# Altium project STM32H750核心板.PrjPcb
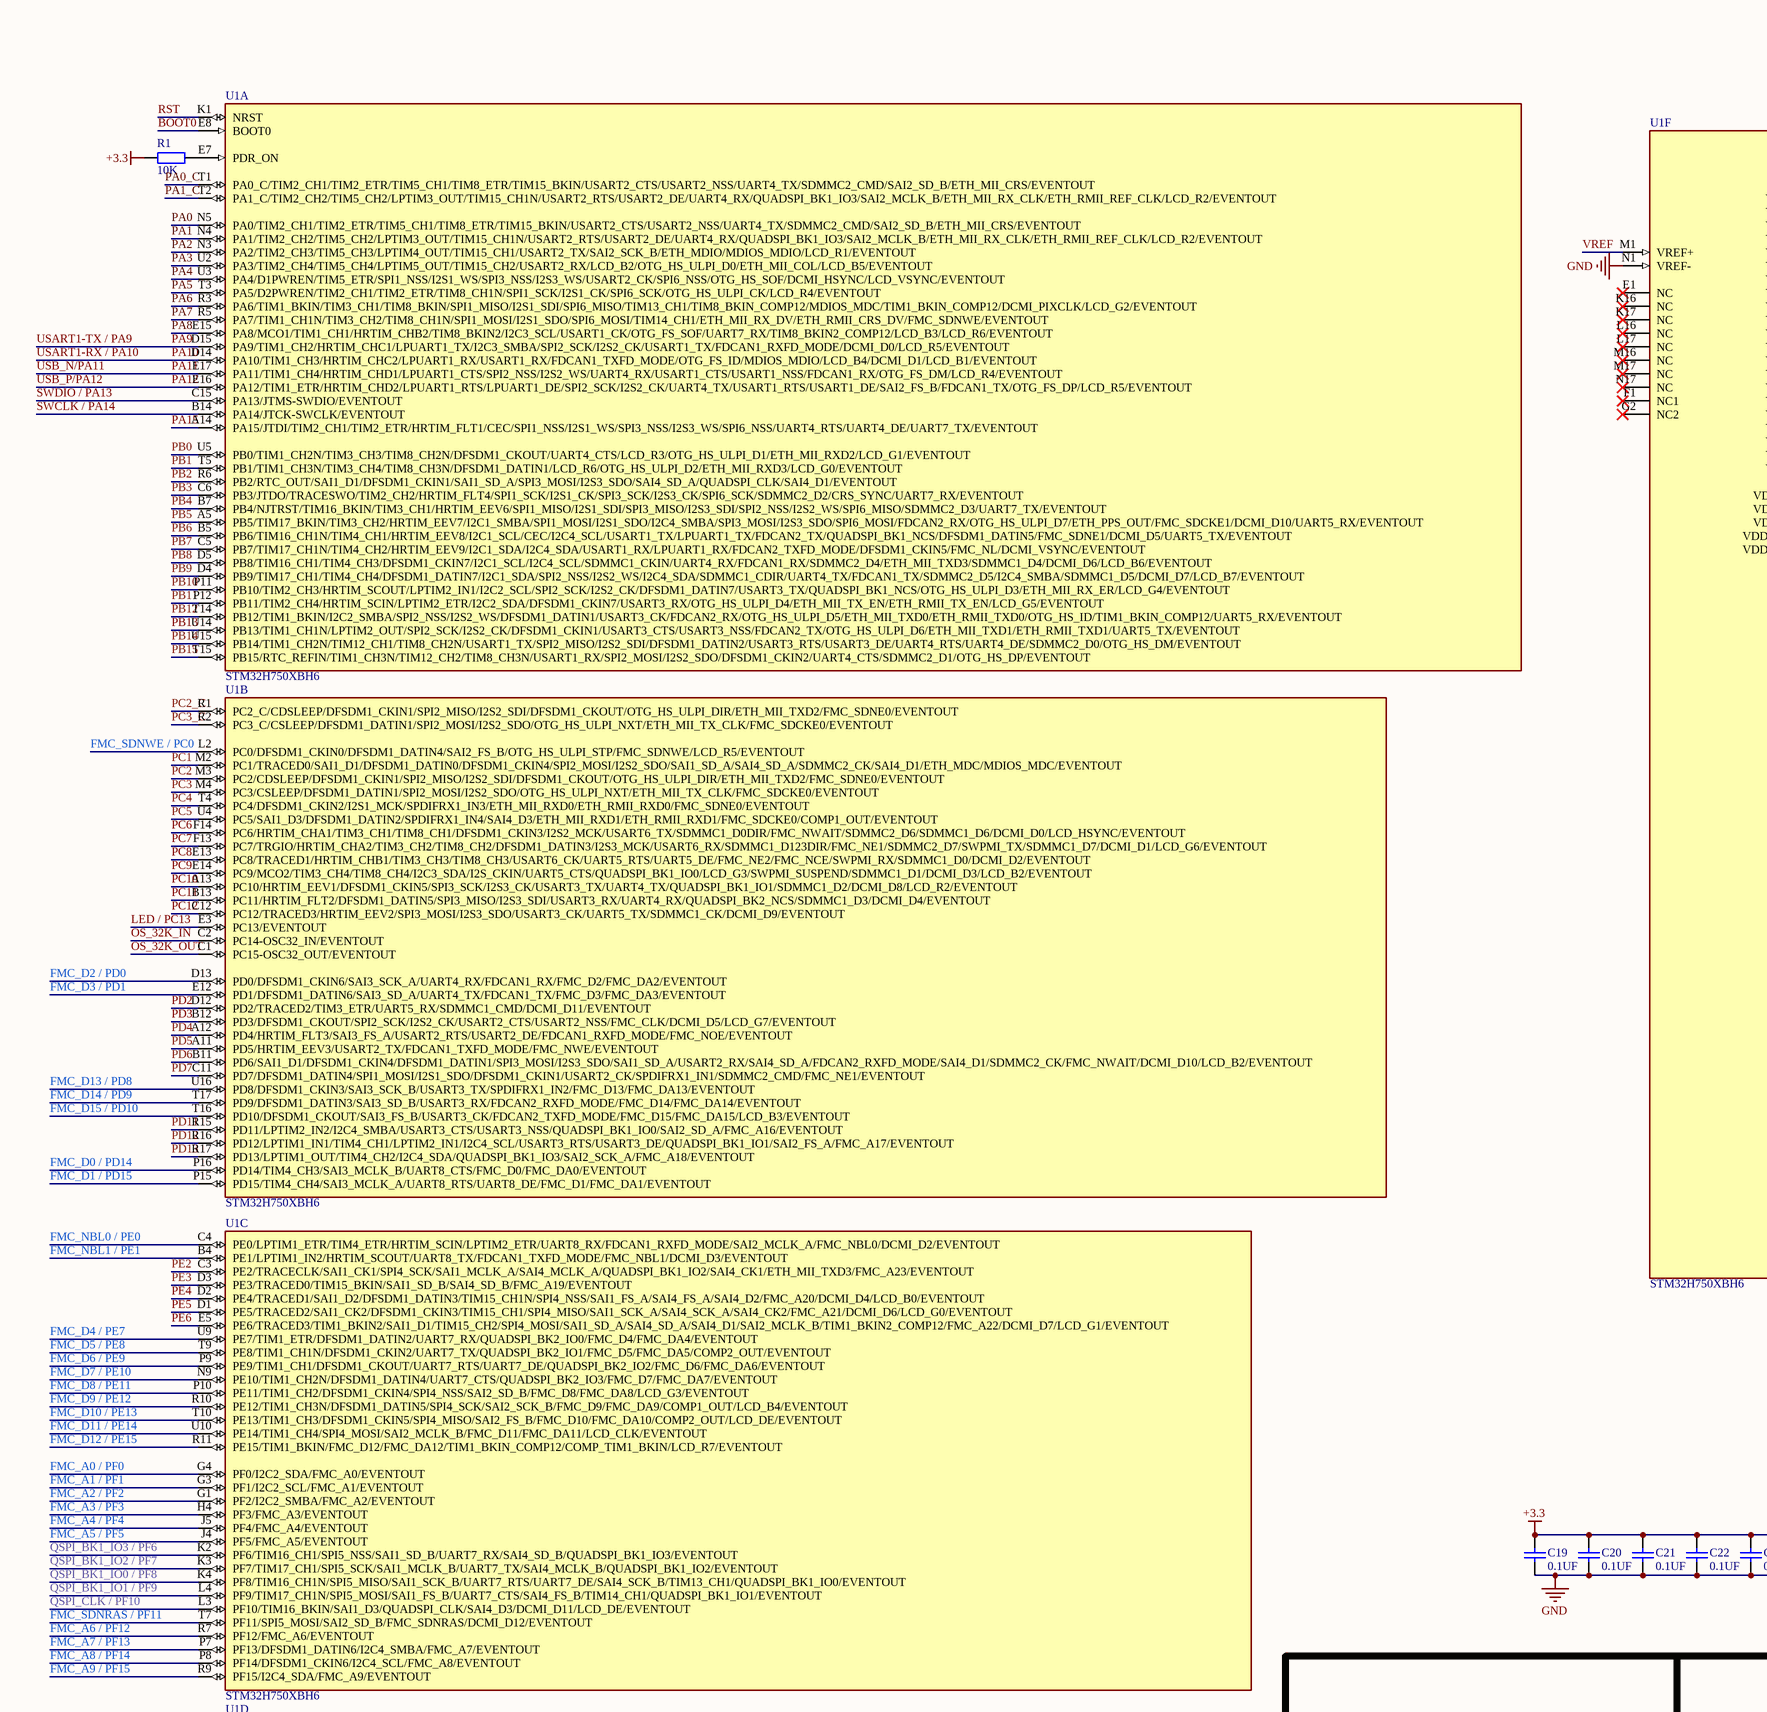
[diagram p0: Sheet1.SchDoc, top left]
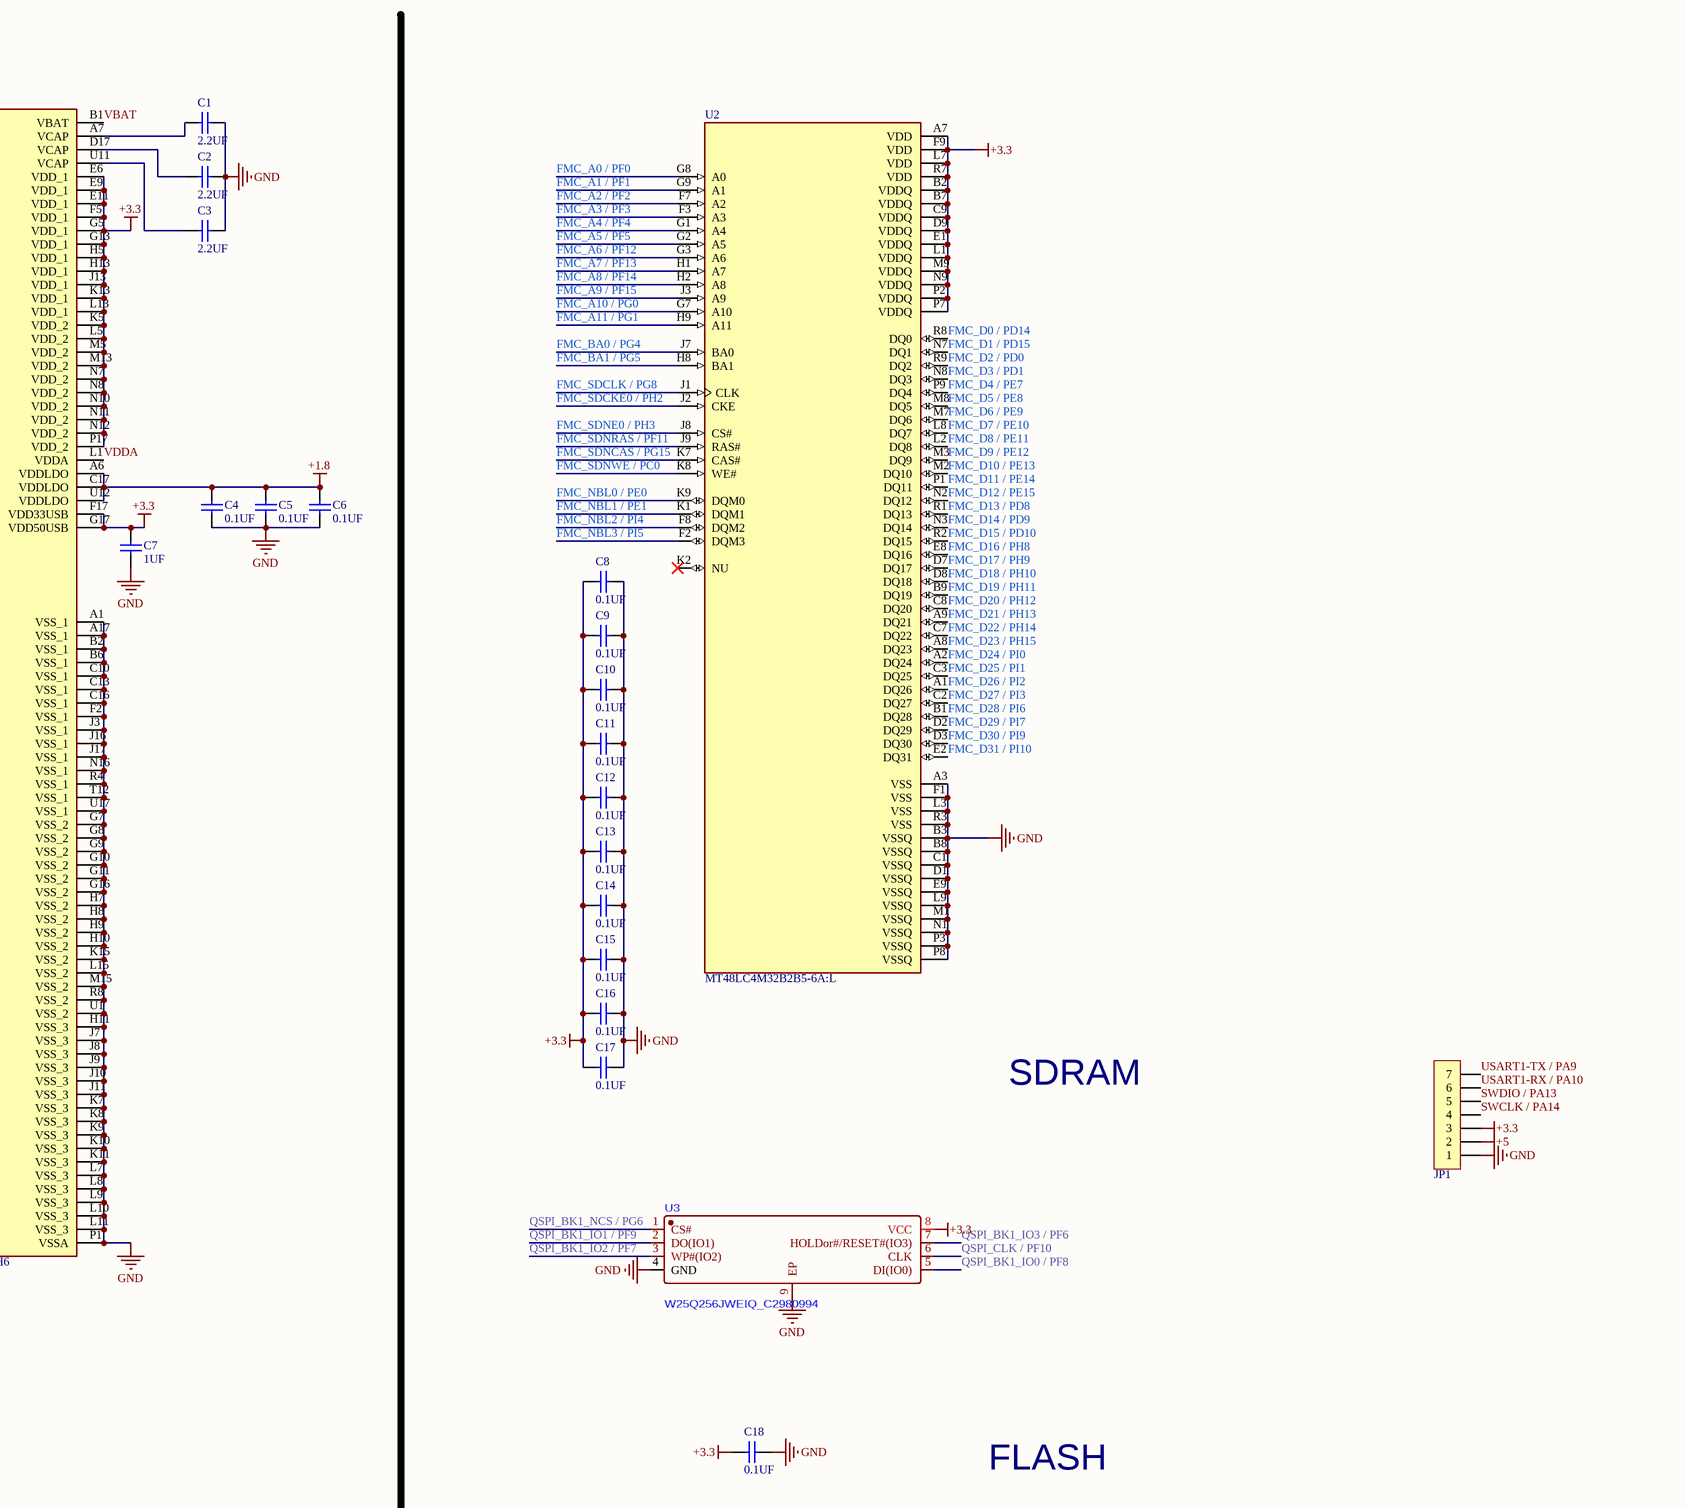
[diagram p1: Sheet1.SchDoc, top right]
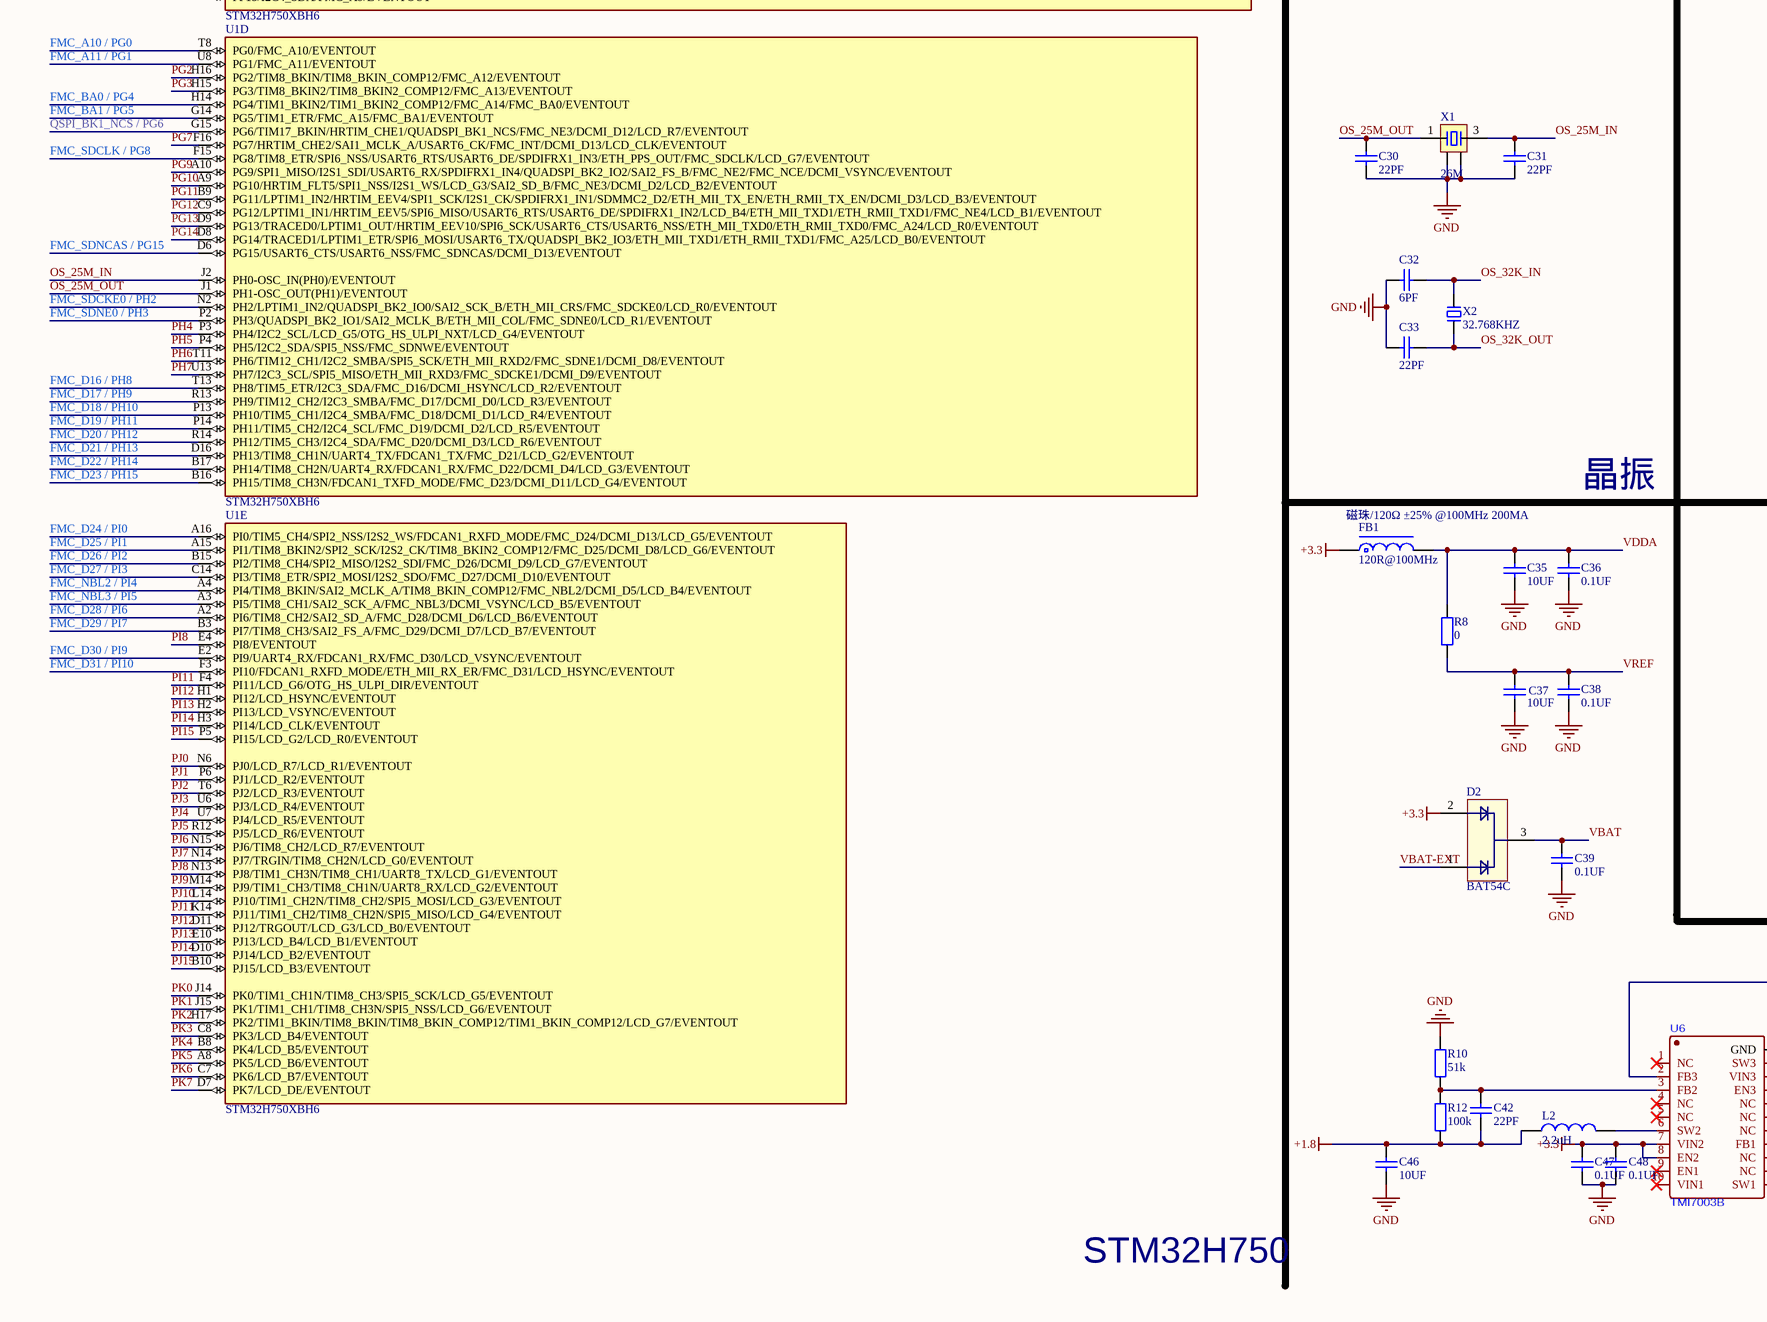
[diagram p2: Sheet1.SchDoc, bottom left]
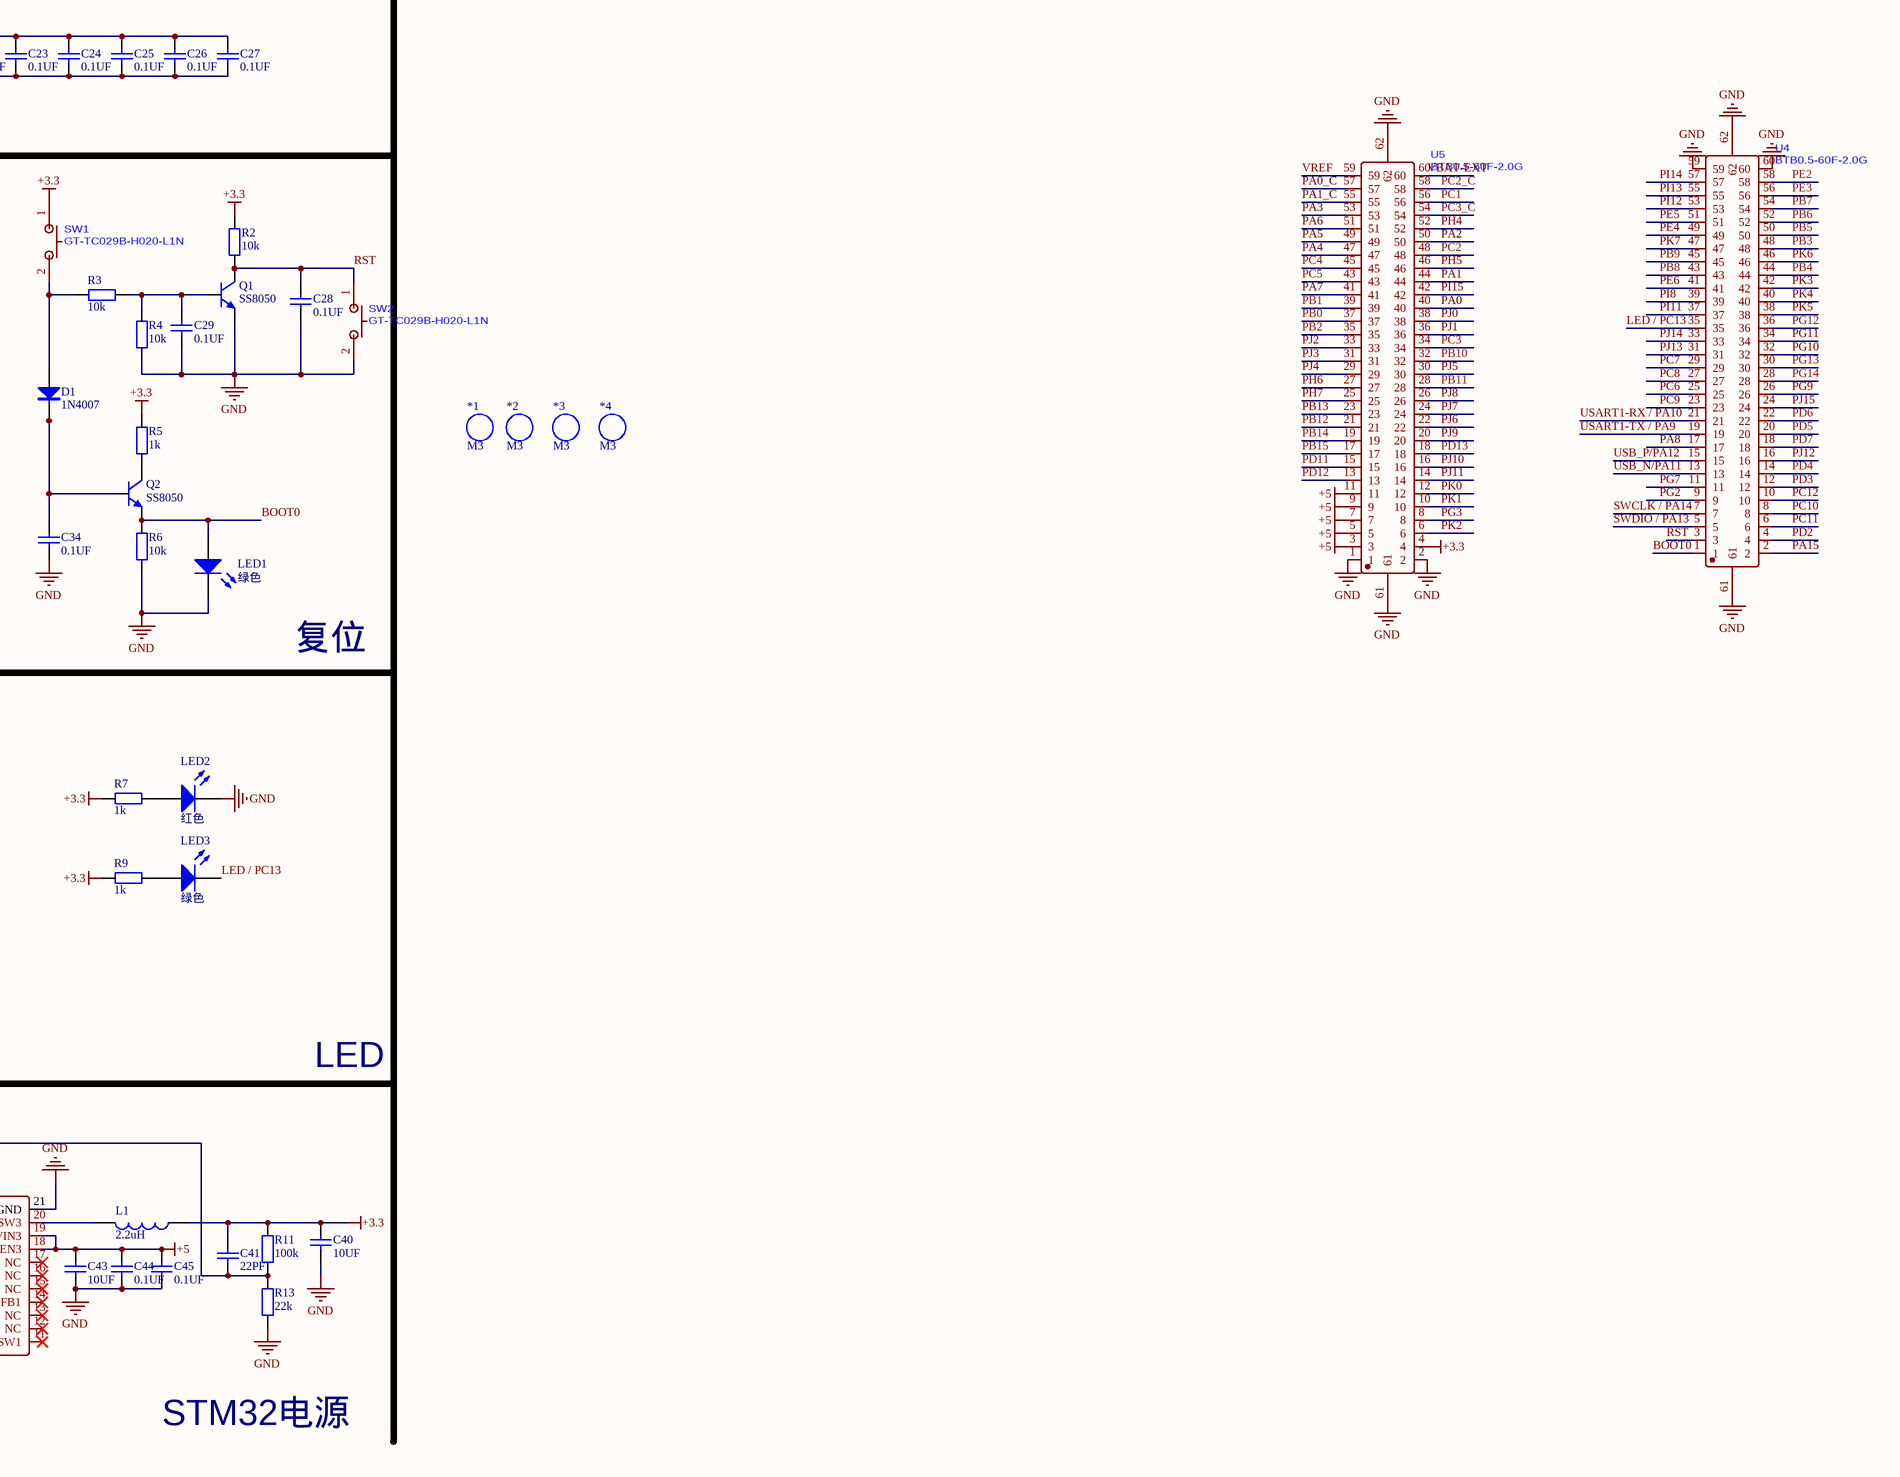
[diagram p3: Sheet1.SchDoc, bottom right]
1 sheet, 86 parts. Net scope: global (net labels, ports and power ports of the same name join across sheets).
Board file: PCB1.PcbDoc

## Sheet Sheet1.SchDoc
size A1; SheetNumber: 1; SheetTotal: 1

### Parts
*1  M3  [M3 125X200]
*2  M3  [M3 125X200]
*3  M3  [M3 125X200]
*4  M3  [M3 125X200]
C1  2.2UF  [C0402_L]
C2  2.2UF  [C0402_L]
C3  2.2UF  [C0402_L]
C4  0.1UF  [C0402_L]
C5  0.1UF  [C0402_L]
C6  0.1UF  [C0402_L]
C7  1UF  [C0402_L]
C8  0.1UF  [C0402_M]
C9  0.1UF  [C0402_M]
C10  0.1UF  [C0402_M]
C11  0.1UF  [C0402_M]
C12  0.1UF  [C0402_M]
C13  0.1UF  [C0402_M]
C14  0.1UF  [C0402_M]
C15  0.1UF  [C0402_M]
C16  0.1UF  [C0402_M]
C17  0.1UF  [C0402_M]
C18  0.1UF  [C0402_L]
C19  0.1UF  [C0402_M]
C20  0.1UF  [C0402_M]
C21  0.1UF  [C0402_M]
C22  0.1UF  [C0402_M]
C23  0.1UF  [C0402_M]
C24  0.1UF  [C0402_M]
C25  0.1UF  [C0402_M]
C26  0.1UF  [C0402_M]
C27  0.1UF  [C0402_M]
C28  0.1UF  [C0402_L]
C29  0.1UF  [C0402_L]
C30  22PF  [C0402_L]
C31  22PF  [C0402_L]
C32  6PF  [C0402_L]
C33  22PF  [C0402_L]
C34  0.1UF  [C0402_L]
C35  10UF  [C0603_L]
C36  0.1UF  [C0402_L]
C37  10UF  [C0603_L]
C38  0.1UF  [C0402_L]
C39  0.1UF  [C0402_L]
C40  10UF  [C0603_L]
C41  22PF  [C0402_L]
C42  22PF  [C0402_L]
C43  10UF  [C0603_L]
C44  0.1UF  [C0402_L]
C45  0.1UF  [C0402_L]
C46  10UF  [C0603_L]
C47  0.1UF  [C0402_L]
C48  0.1UF  [C0402_L]
D1  1N4007  [SOD-123]
D2  BAT54C  [SOT23-3N]
FB1  120R@100MHz  [FB0603]
JP1  CON-6P  [SH1.0-LT-7P]  (value not drawn)
L1  2.2uH  [L0805]
L2  2.2uH  [L0805]
LED1  绿色  [LED0603_G]
LED2  红色  [LED0603_G]
LED3  绿色  [LED0603_G]
Q1  SS8050  [SOT23-3N]
Q2  SS8050  [SOT23-3N]
R1  10K  [R0402_L]
R2  10k  [R0402_L]
R3  10k  [R0402_L]
R4  10k  [R0402_L]
R5  1k  [R0402_L]
R6  10k  [R0402_L]
R7  1k  [R0402_L]
R8  0  [R0402_L]
R9  1k  [R0402_L]
R10  51k  [R0402_L]
R11  100k  [R0402_L]
R12  100k  [R0402_L]
R13  22k  [R0402_L]
SW1  GT-TC029B-H020-L1N  [SW-SMD_L3.9-W2.9-P4.15-LS5.0]
SW2  GT-TC029B-H020-L1N  [SW-SMD_L3.9-W2.9-P4.15-LS5.0]
U1  STM32H750XBH6  [IC_STM32H750XBH6]  (parts A,B,C,D,E,F of 6)
U2  MT48LC4M32B2B5-6A:L  [BGA90C80P9X15_800X1300X100N]
U3  W25Q256JWEIQ_C2980994  [WSON-8_L8.0-W6.0-P1.27-TL-EP-1]
U4  BTB0.5-60F-2.0G  [CONN-SMD_60P-P0.50_BTB0.5-60F-2.0G]
U5  BTB0.5-60F-2.0G  [CONN-SMD_60P-P0.50_BTB0.5-60F-2.0G]
U6  TMI7003B  [QFN-20_L3.0-W3.0-P0.40-BL-EP1.7]
X1  26M  [XTAL-3225-4P]
X2  32.768KHZ  [XTAL-3215-2P]

### Nets
+1.8: C4.1 C5.1 C6.1 C42.2 C46.1 L2.1 R12.1 U1.A6(VDDLDO) U1.C17(VDDLDO) U1.U12(VDDLDO)
+3.3: C7.2 C8.2 C9.2 C10.2 C11.2 C12.2 C13.2 C14.2 C15.2 C16.2 C17.2 C18.2 C19.2 C20.2 C21.2 C22.2 C23.2 C24.2 C25.2 C26.2 C27.2 C40.2 C41.2 C47.2 C48.2 D2.2 FB1.1 JP1.3 L1.1 R1.1 R2.2 R5.2 R7.1 R9.1 R11.1 SW1.1 U1.E6(VDD_1) U1.E9(VDD_1) U1.E11(VDD_1) U1.F5(VDD_1) U1.F17(VDD33USB) U1.G5(VDD_1) U1.G13(VDD_1) U1.G17(VDD50USB) U1.H5(VDD_1) U1.H13(VDD_1) U1.J13(VDD_1) U1.K5(VDD_2) U1.K13(VDD_1) U1.L5(VDD_2) U1.L13(VDD_1) U1.M5(VDD_2) U1.M13(VDD_2) U1.N7(VDD_2) U1.N8(VDD_2) U1.N10(VDD_2) U1.N11(VDD_2) U1.N12(VDD_2) U1.P17(VDD_2) U2.A7(VDD) U2.B2(VDDQ) U2.B7(VDDQ) U2.C9(VDDQ) U2.D9(VDDQ) U2.E1(VDDQ) U2.F9(VDD) U2.L1(VDDQ) U2.L7(VDD) U2.M9(VDDQ) U2.N9(VDDQ) U2.P2(VDDQ) U2.P7(VDDQ) U2.R7(VDD) U3.8(VCC) U5.4 U6.7(VIN2) U6.8(EN2)
+5: C43.2 C44.2 C45.2 JP1.2 U5.3 U5.5 U5.7 U5.9 U5.11 U6.18(EN3) U6.19(VIN3)
GND: C1.1 C2.1 C3.1 C4.2 C5.2 C6.2 C7.1 C8.1 C9.1 C10.1 C11.1 C12.1 C13.1 C14.1 C15.1 C16.1 C17.1 C18.1 C19.1 C20.1 C21.1 C22.1 C23.1 C24.1 C25.1 C26.1 C27.1 C28.2 C29.2 C30.1 C31.1 C32.2 C33.2 C34.2 C35.1 C36.1 C37.1 C38.1 C39.2 C40.1 C43.1 C44.1 C45.1 C46.2 C47.1 C48.1 JP1.1 LED1.2(K) LED2.2(K) Q1.2(E) R4.1 R6.1 R10.2 R13.2 SW2.2 U1.A1(VSS_1) U1.A17(VSS_1) U1.B2(VSS_1) U1.B6(VSS_1) U1.C10(VSS_1) U1.C13(VSS_1) U1.C16(VSS_1) U1.F2(VSS_1) U1.G7(VSS_2) U1.G8(VSS_2) U1.G9(VSS_2) U1.G10(VSS_2) U1.G11(VSS_2) U1.G16(VSS_2) U1.H7(VSS_2) U1.H8(VSS_2) U1.H9(VSS_2) U1.H10(VSS_2) U1.H11(VSS_3) U1.J3(VSS_1) U1.J7(VSS_3) U1.J8(VSS_3) U1.J9(VSS_3) U1.J10(VSS_3) U1.J11(VSS_3) U1.J16(VSS_1) U1.J17(VSS_1) U1.K7(VSS_3) U1.K8(VSS_3) U1.K9(VSS_3) U1.K10(VSS_3) U1.K11(VSS_3) U1.K15(VSS_2) U1.L7(VSS_3) U1.L8(VSS_3) U1.L9(VSS_3) U1.L10(VSS_3) U1.L11(VSS_3) U1.L15(VSS_2) U1.M15(VSS_2) U1.N1(VREF-) U1.N16(VSS_1) U1.P1(VSSA) U1.R4(VSS_1) U1.R8(VSS_2) U1.T12(VSS_1) U1.U1(VSS_2) U1.U17(VSS_1) U2.A3(VSS) U2.B3(VSSQ) U2.B8(VSSQ) U2.C1(VSSQ) U2.D1(VSSQ) U2.E9(VSSQ) U2.F1(VSS) U2.L3(VSS) U2.L9(VSSQ) U2.M1(VSSQ) U2.N1(VSSQ) U2.P3(VSSQ) U2.P8(VSSQ) U2.R3(VSS) U3.4(GND) U3.9(EP) U4.59 U4.60 U4.61 U4.62 U5.1 U5.2 U5.61 U5.62 U6.21(GND) X1.2 X1.4
BOOT0: LED1.1(A) Q2.2(E) R6.2 U1.E8(BOOT0) U4.1
FMC_A0 / PF0: U1.G4(PF0/I2C2_SDA/FMC_A0/EVENTOUT) U2.G8(A0)
FMC_A1 / PF1: U1.G3(PF1/I2C2_SCL/FMC_A1/EVENTOUT) U2.G9(A1)
FMC_A2 / PF2: U1.G1(PF2/I2C2_SMBA/FMC_A2/EVENTOUT) U2.F7(A2)
FMC_A3 / PF3: U1.H4(PF3/FMC_A3/EVENTOUT) U2.F3(A3)
FMC_A4 / PF4: U1.J5(PF4/FMC_A4/EVENTOUT) U2.G1(A4)
FMC_A5 / PF5: U1.J4(PF5/FMC_A5/EVENTOUT) U2.G2(A5)
FMC_A6 / PF12: U1.R7(PF12/FMC_A6/EVENTOUT) U2.G3(A6)
FMC_A7 / PF13: U1.P7(PF13/DFSDM1_DATIN6/I2C4_SMBA/FMC_A7/EVENTOUT) U2.H1(A7)
FMC_A8 / PF14: U1.P8(PF14/DFSDM1_CKIN6/I2C4_SCL/FMC_A8/EVENTOUT) U2.H2(A8)
FMC_A9 / PF15: U1.R9(PF15/I2C4_SDA/FMC_A9/EVENTOUT) U2.J3(A9)
FMC_A10 / PG0: U1.T8(PG0/FMC_A10/EVENTOUT) U2.G7(A10)
FMC_A11 / PG1: U1.U8(PG1/FMC_A11/EVENTOUT) U2.H9(A11)
FMC_BA0 / PG4: U1.H14(PG4/TIM1_BKIN2/TIM1_BKIN2_COMP12/FMC_A14/FMC_BA0/EVENTOUT) U2.J7(BA0)
FMC_BA1 / PG5: U1.G14(PG5/TIM1_ETR/FMC_A15/FMC_BA1/EVENTOUT) U2.H8(BA1)
FMC_D0 / PD14: U1.P16(PD14/TIM4_CH3/SAI3_MCLK_B/UART8_CTS/FMC_D0/FMC_DA0/EVENTOUT) U2.R8(DQ0)
FMC_D1 / PD15: U1.P15(PD15/TIM4_CH4/SAI3_MCLK_A/UART8_RTS/UART8_DE/FMC_D1/FMC_DA1/EVENTOUT) U2.N7(DQ1)
FMC_D2 / PD0: U1.D13(PD0/DFSDM1_CKIN6/SAI3_SCK_A/UART4_RX/FDCAN1_RX/FMC_D2/FMC_DA2/EVENTOUT) U2.R9(DQ2)
FMC_D3 / PD1: U1.E12(PD1/DFSDM1_DATIN6/SAI3_SD_A/UART4_TX/FDCAN1_TX/FMC_D3/FMC_DA3/EVENTOUT) U2.N8(DQ3)
FMC_D4 / PE7: U1.U9(PE7/TIM1_ETR/DFSDM1_DATIN2/UART7_RX/QUADSPI_BK2_IO0/FMC_D4/FMC_DA4/EVENTOUT) U2.P9(DQ4)
FMC_D5 / PE8: U1.T9(PE8/TIM1_CH1N/DFSDM1_CKIN2/UART7_TX/QUADSPI_BK2_IO1/FMC_D5/FMC_DA5/COMP2_OUT/EVENTOUT) U2.M8(DQ5)
FMC_D6 / PE9: U1.P9(PE9/TIM1_CH1/DFSDM1_CKOUT/UART7_RTS/UART7_DE/QUADSPI_BK2_IO2/FMC_D6/FMC_DA6/EVENTOUT) U2.M7(DQ6)
FMC_D7 / PE10: U1.N9(PE10/TIM1_CH2N/DFSDM1_DATIN4/UART7_CTS/QUADSPI_BK2_IO3/FMC_D7/FMC_DA7/EVENTOUT) U2.L8(DQ7)
FMC_D8 / PE11: U1.P10(PE11/TIM1_CH2/DFSDM1_CKIN4/SPI4_NSS/SAI2_SD_B/FMC_D8/FMC_DA8/LCD_G3/EVENTOUT) U2.L2(DQ8)
FMC_D9 / PE12: U1.R10(PE12/TIM1_CH3N/DFSDM1_DATIN5/SPI4_SCK/SAI2_SCK_B/FMC_D9/FMC_DA9/COMP1_OUT/LCD_B4/EVENTOUT) U2.M3(DQ9)
FMC_D10 / PE13: U1.T10(PE13/TIM1_CH3/DFSDM1_CKIN5/SPI4_MISO/SAI2_FS_B/FMC_D10/FMC_DA10/COMP2_OUT/LCD_DE/EVENTOUT) U2.M2(DQ10)
FMC_D11 / PE14: U1.U10(PE14/TIM1_CH4/SPI4_MOSI/SAI2_MCLK_B/FMC_D11/FMC_DA11/LCD_CLK/EVENTOUT) U2.P1(DQ11)
FMC_D12 / PE15: U1.R11(PE15/TIM1_BKIN/FMC_D12/FMC_DA12/TIM1_BKIN_COMP12/COMP_TIM1_BKIN/LCD_R7/EVENTOUT) U2.N2(DQ12)
FMC_D13 / PD8: U1.U16(PD8/DFSDM1_CKIN3/SAI3_SCK_B/USART3_TX/SPDIFRX1_IN2/FMC_D13/FMC_DA13/EVENTOUT) U2.R1(DQ13)
FMC_D14 / PD9: U1.T17(PD9/DFSDM1_DATIN3/SAI3_SD_B/USART3_RX/FDCAN2_RXFD_MODE/FMC_D14/FMC_DA14/EVENTOUT) U2.N3(DQ14)
FMC_D15 / PD10: U1.T16(PD10/DFSDM1_CKOUT/SAI3_FS_B/USART3_CK/FDCAN2_TXFD_MODE/FMC_D15/FMC_DA15/LCD_B3/EVENTOUT) U2.R2(DQ15)
FMC_D16 / PH8: U1.T13(PH8/TIM5_ETR/I2C3_SDA/FMC_D16/DCMI_HSYNC/LCD_R2/EVENTOUT) U2.E8(DQ16)
FMC_D17 / PH9: U1.R13(PH9/TIM12_CH2/I2C3_SMBA/FMC_D17/DCMI_D0/LCD_R3/EVENTOUT) U2.D7(DQ17)
FMC_D18 / PH10: U1.P13(PH10/TIM5_CH1/I2C4_SMBA/FMC_D18/DCMI_D1/LCD_R4/EVENTOUT) U2.D8(DQ18)
FMC_D19 / PH11: U1.P14(PH11/TIM5_CH2/I2C4_SCL/FMC_D19/DCMI_D2/LCD_R5/EVENTOUT) U2.B9(DQ19)
FMC_D20 / PH12: U1.R14(PH12/TIM5_CH3/I2C4_SDA/FMC_D20/DCMI_D3/LCD_R6/EVENTOUT) U2.C8(DQ20)
FMC_D21 / PH13: U1.D16(PH13/TIM8_CH1N/UART4_TX/FDCAN1_TX/FMC_D21/LCD_G2/EVENTOUT) U2.A9(DQ21)
FMC_D22 / PH14: U1.B17(PH14/TIM8_CH2N/UART4_RX/FDCAN1_RX/FMC_D22/DCMI_D4/LCD_G3/EVENTOUT) U2.C7(DQ22)
FMC_D23 / PH15: U1.B16(PH15/TIM8_CH3N/FDCAN1_TXFD_MODE/FMC_D23/DCMI_D11/LCD_G4/EVENTOUT) U2.A8(DQ23)
FMC_D24 / PI0: U1.A16(PI0/TIM5_CH4/SPI2_NSS/I2S2_WS/FDCAN1_RXFD_MODE/FMC_D24/DCMI_D13/LCD_G5/EVENTOUT) U2.A2(DQ24)
FMC_D25 / PI1: U1.A15(PI1/TIM8_BKIN2/SPI2_SCK/I2S2_CK/TIM8_BKIN2_COMP12/FMC_D25/DCMI_D8/LCD_G6/EVENTOUT) U2.C3(DQ25)
FMC_D26 / PI2: U1.B15(PI2/TIM8_CH4/SPI2_MISO/I2S2_SDI/FMC_D26/DCMI_D9/LCD_G7/EVENTOUT) U2.A1(DQ26)
FMC_D27 / PI3: U1.C14(PI3/TIM8_ETR/SPI2_MOSI/I2S2_SDO/FMC_D27/DCMI_D10/EVENTOUT) U2.C2(DQ27)
FMC_D28 / PI6: U1.A2(PI6/TIM8_CH2/SAI2_SD_A/FMC_D28/DCMI_D6/LCD_B6/EVENTOUT) U2.B1(DQ28)
FMC_D29 / PI7: U1.B3(PI7/TIM8_CH3/SAI2_FS_A/FMC_D29/DCMI_D7/LCD_B7/EVENTOUT) U2.D2(DQ29)
FMC_D30 / PI9: U1.E2(PI9/UART4_RX/FDCAN1_RX/FMC_D30/LCD_VSYNC/EVENTOUT) U2.D3(DQ30)
FMC_D31 / PI10: U1.F3(PI10/FDCAN1_RXFD_MODE/ETH_MII_RX_ER/FMC_D31/LCD_HSYNC/EVENTOUT) U2.E2(DQ31)
FMC_NBL0 / PE0: U1.C4(PE0/LPTIM1_ETR/TIM4_ETR/HRTIM_SCIN/LPTIM2_ETR/UART8_RX/FDCAN1_RXFD_MODE/SAI2_MCLK_A/FMC_NBL0/DCMI_D2/EVENTOUT) U2.K9(DQM0)
FMC_NBL1 / PE1: U1.B4(PE1/LPTIM1_IN2/HRTIM_SCOUT/UART8_TX/FDCAN1_TXFD_MODE/FMC_NBL1/DCMI_D3/EVENTOUT) U2.K1(DQM1)
FMC_NBL2 / PI4: U1.A4(PI4/TIM8_BKIN/SAI2_MCLK_A/TIM8_BKIN_COMP12/FMC_NBL2/DCMI_D5/LCD_B4/EVENTOUT) U2.F8(DQM2)
FMC_NBL3 / PI5: U1.A3(PI5/TIM8_CH1/SAI2_SCK_A/FMC_NBL3/DCMI_VSYNC/LCD_B5/EVENTOUT) U2.F2(DQM3)
FMC_SDCKE0 / PH2: U1.N2(PH2/LPTIM1_IN2/QUADSPI_BK2_IO0/SAI2_SCK_B/ETH_MII_CRS/FMC_SDCKE0/LCD_R0/EVENTOUT) U2.J2(CKE)
FMC_SDCLK / PG8: U1.F15(PG8/TIM8_ETR/SPI6_NSS/USART6_RTS/USART6_DE/SPDIFRX1_IN3/ETH_PPS_OUT/FMC_SDCLK/LCD_G7/EVENTOUT) U2.J1(CLK)
FMC_SDNCAS / PG15: U1.D6(PG15/USART6_CTS/USART6_NSS/FMC_SDNCAS/DCMI_D13/EVENTOUT) U2.K7(CAS#)
FMC_SDNE0 / PH3: U1.P2(PH3/QUADSPI_BK2_IO1/SAI2_MCLK_B/ETH_MII_COL/FMC_SDNE0/LCD_R1/EVENTOUT) U2.J8(CS#)
FMC_SDNRAS / PF11: U1.T7(PF11/SPI5_MOSI/SAI2_SD_B/FMC_SDNRAS/DCMI_D12/EVENTOUT) U2.J9(RAS#)
FMC_SDNWE / PC0: U1.L2(PC0/DFSDM1_CKIN0/DFSDM1_DATIN4/SAI2_FS_B/OTG_HS_ULPI_STP/FMC_SDNWE/LCD_R5/EVENTOUT) U2.K8(WE#)
LED / PC13: LED3.2(K) U1.E3(PC13/EVENTOUT) U4.35
OS_25M_IN: C31.2 U1.J2(PH0-OSC_IN(PH0)/EVENTOUT) X1.3
OS_25M_OUT: C30.2 U1.J1(PH1-OSC_OUT(PH1)/EVENTOUT) X1.1
OS_32K_IN: C32.1 U1.C2(PC14-OSC32_IN/EVENTOUT) X2.2
OS_32K_OUT: C33.1 U1.C1(PC15-OSC32_OUT/EVENTOUT) X2.1
PA0: U1.N5(PA0/TIM2_CH1/TIM2_ETR/TIM5_CH1/TIM8_ETR/TIM15_BKIN/USART2_CTS/USART2_NSS/UART4_TX/SDMMC2_CMD/SAI2_SD_B/ETH_MII_CRS/EVENTOUT) U5.40
PA0_C: U1.T1(PA0_C/TIM2_CH1/TIM2_ETR/TIM5_CH1/TIM8_ETR/TIM15_BKIN/USART2_CTS/USART2_NSS/UART4_TX/SDMMC2_CMD/SAI2_SD_B/ETH_MII_CRS/EVENTOUT) U5.57
PA1: U1.N4(PA1/TIM2_CH2/TIM5_CH2/LPTIM3_OUT/TIM15_CH1N/USART2_RTS/USART2_DE/UART4_RX/QUADSPI_BK1_IO3/SAI2_MCLK_B/ETH_MII_RX_CLK/ETH_RMII_REF_CLK/LCD_R2/EVENTOUT) U5.44
PA1_C: U1.T2(PA1_C/TIM2_CH2/TIM5_CH2/LPTIM3_OUT/TIM15_CH1N/USART2_RTS/USART2_DE/UART4_RX/QUADSPI_BK1_IO3/SAI2_MCLK_B/ETH_MII_RX_CLK/ETH_RMII_REF_CLK/LCD_R2/EVENTOUT) U5.55
PA2: U1.N3(PA2/TIM2_CH3/TIM5_CH3/LPTIM4_OUT/TIM15_CH1/USART2_TX/SAI2_SCK_B/ETH_MDIO/MDIOS_MDIO/LCD_R1/EVENTOUT) U5.50
PA3: U1.U2(PA3/TIM2_CH4/TIM5_CH4/LPTIM5_OUT/TIM15_CH2/USART2_RX/LCD_B2/OTG_HS_ULPI_D0/ETH_MII_COL/LCD_B5/EVENTOUT) U5.53
PA4: U1.U3(PA4/D1PWREN/TIM5_ETR/SPI1_NSS/I2S1_WS/SPI3_NSS/I2S3_WS/USART2_CK/SPI6_NSS/OTG_HS_SOF/DCMI_HSYNC/LCD_VSYNC/EVENTOUT) U5.47
PA5: U1.T3(PA5/D2PWREN/TIM2_CH1/TIM2_ETR/TIM8_CH1N/SPI1_SCK/I2S1_CK/SPI6_SCK/OTG_HS_ULPI_CK/LCD_R4/EVENTOUT) U5.49
PA6: U1.R3(PA6/TIM1_BKIN/TIM3_CH1/TIM8_BKIN/SPI1_MISO/I2S1_SDI/SPI6_MISO/TIM13_CH1/TIM8_BKIN_COMP12/MDIOS_MDC/TIM1_BKIN_COMP12/DCMI_PIXCLK/LCD_G2/EVENTOUT) U5.51
PA7: U1.R5(PA7/TIM1_CH1N/TIM3_CH2/TIM8_CH1N/SPI1_MOSI/I2S1_SDO/SPI6_MOSI/TIM14_CH1/ETH_MII_RX_DV/ETH_RMII_CRS_DV/FMC_SDNWE/EVENTOUT) U5.41
PA8: U1.E15(PA8/MCO1/TIM1_CH1/HRTIM_CHB2/TIM8_BKIN2/I2C3_SCL/USART1_CK/OTG_FS_SOF/UART7_RX/TIM8_BKIN2_COMP12/LCD_B3/LCD_R6/EVENTOUT) U4.17
PA9: JP1.7 U1.D15(PA9/TIM1_CH2/HRTIM_CHC1/LPUART1_TX/I2C3_SMBA/SPI2_SCK/I2S2_CK/USART1_TX/FDCAN1_RXFD_MODE/DCMI_D0/LCD_R5/EVENTOUT) U4.19  [also labelled USART1-TX / PA9]
PA10: JP1.6 U1.D14(PA10/TIM1_CH3/HRTIM_CHC2/LPUART1_RX/USART1_RX/FDCAN1_TXFD_MODE/OTG_FS_ID/MDIOS_MDIO/LCD_B4/DCMI_D1/LCD_B1/EVENTOUT) U4.21  [also labelled USART1-RX / PA10]
PA11: U1.E17(PA11/TIM1_CH4/HRTIM_CHD1/LPUART1_CTS/SPI2_NSS/I2S2_WS/UART4_RX/USART1_CTS/USART1_NSS/FDCAN1_RX/OTG_FS_DM/LCD_R4/EVENTOUT) U4.13  [also labelled USB_N/PA11]
PA12: U1.E16(PA12/TIM1_ETR/HRTIM_CHD2/LPUART1_RTS/LPUART1_DE/SPI2_SCK/I2S2_CK/UART4_TX/USART1_RTS/USART1_DE/SAI2_FS_B/FDCAN1_TX/OTG_FS_DP/LCD_R5/EVENTOUT) U4.15  [also labelled USB_P/PA12]
PA15: U1.A14(PA15/JTDI/TIM2_CH1/TIM2_ETR/HRTIM_FLT1/CEC/SPI1_NSS/I2S1_WS/SPI3_NSS/I2S3_WS/SPI6_NSS/UART4_RTS/UART4_DE/UART7_TX/EVENTOUT) U4.2
PB0: U1.U5(PB0/TIM1_CH2N/TIM3_CH3/TIM8_CH2N/DFSDM1_CKOUT/UART4_CTS/LCD_R3/OTG_HS_ULPI_D1/ETH_MII_RXD2/LCD_G1/EVENTOUT) U5.37
PB1: U1.T5(PB1/TIM1_CH3N/TIM3_CH4/TIM8_CH3N/DFSDM1_DATIN1/LCD_R6/OTG_HS_ULPI_D2/ETH_MII_RXD3/LCD_G0/EVENTOUT) U5.39
PB2: U1.R6(PB2/RTC_OUT/SAI1_D1/DFSDM1_CKIN1/SAI1_SD_A/SPI3_MOSI/I2S3_SDO/SAI4_SD_A/QUADSPI_CLK/SAI4_D1/EVENTOUT) U5.35
PB3: U1.C6(PB3/JTDO/TRACESWO/TIM2_CH2/HRTIM_FLT4/SPI1_SCK/I2S1_CK/SPI3_SCK/I2S3_CK/SPI6_SCK/SDMMC2_D2/CRS_SYNC/UART7_RX/EVENTOUT) U4.48
PB4: U1.B7(PB4/NJTRST/TIM16_BKIN/TIM3_CH1/HRTIM_EEV6/SPI1_MISO/I2S1_SDI/SPI3_MISO/I2S3_SDI/SPI2_NSS/I2S2_WS/SPI6_MISO/SDMMC2_D3/UART7_TX/EVENTOUT) U4.44
PB5: U1.A5(PB5/TIM17_BKIN/TIM3_CH2/HRTIM_EEV7/I2C1_SMBA/SPI1_MOSI/I2S1_SDO/I2C4_SMBA/SPI3_MOSI/I2S3_SDO/SPI6_MOSI/FDCAN2_RX/OTG_HS_ULPI_D7/ETH_PPS_OUT/FMC_SDCKE1/DCMI_D10/UART5_RX/EVENTOUT) U4.50
PB6: U1.B5(PB6/TIM16_CH1N/TIM4_CH1/HRTIM_EEV8/I2C1_SCL/CEC/I2C4_SCL/USART1_TX/LPUART1_TX/FDCAN2_TX/QUADSPI_BK1_NCS/DFSDM1_DATIN5/FMC_SDNE1/DCMI_D5/UART5_TX/EVENTOUT) U4.52
PB7: U1.C5(PB7/TIM17_CH1N/TIM4_CH2/HRTIM_EEV9/I2C1_SDA/I2C4_SDA/USART1_RX/LPUART1_RX/FDCAN2_TXFD_MODE/DFSDM1_CKIN5/FMC_NL/DCMI_VSYNC/EVENTOUT) U4.54
PB8: U1.D5(PB8/TIM16_CH1/TIM4_CH3/DFSDM1_CKIN7/I2C1_SCL/I2C4_SCL/SDMMC1_CKIN/UART4_RX/FDCAN1_RX/SDMMC2_D4/ETH_MII_TXD3/SDMMC1_D4/DCMI_D6/LCD_B6/EVENTOUT) U4.43
PB9: U1.D4(PB9/TIM17_CH1/TIM4_CH4/DFSDM1_DATIN7/I2C1_SDA/SPI2_NSS/I2S2_WS/I2C4_SDA/SDMMC1_CDIR/UART4_TX/FDCAN1_TX/SDMMC2_D5/I2C4_SMBA/SDMMC1_D5/DCMI_D7/LCD_B7/EVENTOUT) U4.45
PB10: U1.P11(PB10/TIM2_CH3/HRTIM_SCOUT/LPTIM2_IN1/I2C2_SCL/SPI2_SCK/I2S2_CK/DFSDM1_DATIN7/USART3_TX/QUADSPI_BK1_NCS/OTG_HS_ULPI_D3/ETH_MII_RX_ER/LCD_G4/EVENTOUT) U5.32
PB11: U1.P12(PB11/TIM2_CH4/HRTIM_SCIN/LPTIM2_ETR/I2C2_SDA/DFSDM1_CKIN7/USART3_RX/OTG_HS_ULPI_D4/ETH_MII_TX_EN/ETH_RMII_TX_EN/LCD_G5/EVENTOUT) U5.28
PB12: U1.T14(PB12/TIM1_BKIN/I2C2_SMBA/SPI2_NSS/I2S2_WS/DFSDM1_DATIN1/USART3_CK/FDCAN2_RX/OTG_HS_ULPI_D5/ETH_MII_TXD0/ETH_RMII_TXD0/OTG_HS_ID/TIM1_BKIN_COMP12/UART5_RX/EVENTOUT) U5.21
PB13: U1.U14(PB13/TIM1_CH1N/LPTIM2_OUT/SPI2_SCK/I2S2_CK/DFSDM1_CKIN1/USART3_CTS/USART3_NSS/FDCAN2_TX/OTG_HS_ULPI_D6/ETH_MII_TXD1/ETH_RMII_TXD1/UART5_TX/EVENTOUT) U5.23
PB14: U1.U15(PB14/TIM1_CH2N/TIM12_CH1/TIM8_CH2N/USART1_TX/SPI2_MISO/I2S2_SDI/DFSDM1_DATIN2/USART3_RTS/USART3_DE/UART4_RTS/UART4_DE/SDMMC2_D0/OTG_HS_DM/EVENTOUT) U5.19
PB15: U1.T15(PB15/RTC_REFIN/TIM1_CH3N/TIM12_CH2/TIM8_CH3N/USART1_RX/SPI2_MOSI/I2S2_SDO/DFSDM1_CKIN2/UART4_CTS/SDMMC2_D1/OTG_HS_DP/EVENTOUT) U5.17
PC1: U1.M2(PC1/TRACED0/SAI1_D1/DFSDM1_DATIN0/DFSDM1_CKIN4/SPI2_MOSI/I2S2_SDO/SAI1_SD_A/SAI4_SD_A/SDMMC2_CK/SAI4_D1/ETH_MDC/MDIOS_MDC/EVENTOUT) U5.56
PC2: U1.M3(PC2/CDSLEEP/DFSDM1_CKIN1/SPI2_MISO/I2S2_SDI/DFSDM1_CKOUT/OTG_HS_ULPI_DIR/ETH_MII_TXD2/FMC_SDNE0/EVENTOUT) U5.48
PC2_C: U1.R1(PC2_C/CDSLEEP/DFSDM1_CKIN1/SPI2_MISO/I2S2_SDI/DFSDM1_CKOUT/OTG_HS_ULPI_DIR/ETH_MII_TXD2/FMC_SDNE0/EVENTOUT) U5.58
PC3: U1.M4(PC3/CSLEEP/DFSDM1_DATIN1/SPI2_MOSI/I2S2_SDO/OTG_HS_ULPI_NXT/ETH_MII_TX_CLK/FMC_SDCKE0/EVENTOUT) U5.34
PC3_C: U1.R2(PC3_C/CSLEEP/DFSDM1_DATIN1/SPI2_MOSI/I2S2_SDO/OTG_HS_ULPI_NXT/ETH_MII_TX_CLK/FMC_SDCKE0/EVENTOUT) U5.54
PC4: U1.T4(PC4/DFSDM1_CKIN2/I2S1_MCK/SPDIFRX1_IN3/ETH_MII_RXD0/ETH_RMII_RXD0/FMC_SDNE0/EVENTOUT) U5.45
PC5: U1.U4(PC5/SAI1_D3/DFSDM1_DATIN2/SPDIFRX1_IN4/SAI4_D3/ETH_MII_RXD1/ETH_RMII_RXD1/FMC_SDCKE0/COMP1_OUT/EVENTOUT) U5.43
PC6: U1.F14(PC6/HRTIM_CHA1/TIM3_CH1/TIM8_CH1/DFSDM1_CKIN3/I2S2_MCK/USART6_TX/SDMMC1_D0DIR/FMC_NWAIT/SDMMC2_D6/SDMMC1_D6/DCMI_D0/LCD_HSYNC/EVENTOUT) U4.25
PC7: U1.F13(PC7/TRGIO/HRTIM_CHA2/TIM3_CH2/TIM8_CH2/DFSDM1_DATIN3/I2S3_MCK/USART6_RX/SDMMC1_D123DIR/FMC_NE1/SDMMC2_D7/SWPMI_TX/SDMMC1_D7/DCMI_D1/LCD_G6/EVENTOUT) U4.29
PC8: U1.E13(PC8/TRACED1/HRTIM_CHB1/TIM3_CH3/TIM8_CH3/USART6_CK/UART5_RTS/UART5_DE/FMC_NE2/FMC_NCE/SWPMI_RX/SDMMC1_D0/DCMI_D2/EVENTOUT) U4.27
PC9: U1.E14(PC9/MCO2/TIM3_CH4/TIM8_CH4/I2C3_SDA/I2S_CKIN/UART5_CTS/QUADSPI_BK1_IO0/LCD_G3/SWPMI_SUSPEND/SDMMC1_D1/DCMI_D3/LCD_B2/EVENTOUT) U4.23
PC10: U1.A13(PC10/HRTIM_EEV1/DFSDM1_CKIN5/SPI3_SCK/I2S3_CK/USART3_TX/UART4_TX/QUADSPI_BK1_IO1/SDMMC1_D2/DCMI_D8/LCD_R2/EVENTOUT) U4.8
PC11: U1.B13(PC11/HRTIM_FLT2/DFSDM1_DATIN5/SPI3_MISO/I2S3_SDI/USART3_RX/UART4_RX/QUADSPI_BK2_NCS/SDMMC1_D3/DCMI_D4/EVENTOUT) U4.6
PC12: U1.C12(PC12/TRACED3/HRTIM_EEV2/SPI3_MOSI/I2S3_SDO/USART3_CK/UART5_TX/SDMMC1_CK/DCMI_D9/EVENTOUT) U4.10
PD2: U1.D12(PD2/TRACED2/TIM3_ETR/UART5_RX/SDMMC1_CMD/DCMI_D11/EVENTOUT) U4.4
PD3: U1.B12(PD3/DFSDM1_CKOUT/SPI2_SCK/I2S2_CK/USART2_CTS/USART2_NSS/FMC_CLK/DCMI_D5/LCD_G7/EVENTOUT) U4.12
PD4: U1.A12(PD4/HRTIM_FLT3/SAI3_FS_A/USART2_RTS/USART2_DE/FDCAN1_RXFD_MODE/FMC_NOE/EVENTOUT) U4.14
PD5: U1.A11(PD5/HRTIM_EEV3/USART2_TX/FDCAN1_TXFD_MODE/FMC_NWE/EVENTOUT) U4.20
PD6: U1.B11(PD6/SAI1_D1/DFSDM1_CKIN4/DFSDM1_DATIN1/SPI3_MOSI/I2S3_SDO/SAI1_SD_A/USART2_RX/SAI4_SD_A/FDCAN2_RXFD_MODE/SAI4_D1/SDMMC2_CK/FMC_NWAIT/DCMI_D10/LCD_B2/EVENTOUT) U4.22
PD7: U1.C11(PD7/DFSDM1_DATIN4/SPI1_MOSI/I2S1_SDO/DFSDM1_CKIN1/USART2_CK/SPDIFRX1_IN1/SDMMC2_CMD/FMC_NE1/EVENTOUT) U4.18
PD11: U1.R15(PD11/LPTIM2_IN2/I2C4_SMBA/USART3_CTS/USART3_NSS/QUADSPI_BK1_IO0/SAI2_SD_A/FMC_A16/EVENTOUT) U5.15
PD12: U1.R16(PD12/LPTIM1_IN1/TIM4_CH1/LPTIM2_IN1/I2C4_SCL/USART3_RTS/USART3_DE/QUADSPI_BK1_IO1/SAI2_FS_A/FMC_A17/EVENTOUT) U5.13
PD13: U1.R17(PD13/LPTIM1_OUT/TIM4_CH2/I2C4_SDA/QUADSPI_BK1_IO3/SAI2_SCK_A/FMC_A18/EVENTOUT) U5.18
PE2: U1.C3(PE2/TRACECLK/SAI1_CK1/SPI4_SCK/SAI1_MCLK_A/SAI4_MCLK_A/QUADSPI_BK1_IO2/SAI4_CK1/ETH_MII_TXD3/FMC_A23/EVENTOUT) U4.58
PE3: U1.D3(PE3/TRACED0/TIM15_BKIN/SAI1_SD_B/SAI4_SD_B/FMC_A19/EVENTOUT) U4.56
PE4: U1.D2(PE4/TRACED1/SAI1_D2/DFSDM1_DATIN3/TIM15_CH1N/SPI4_NSS/SAI1_FS_A/SAI4_FS_A/SAI4_D2/FMC_A20/DCMI_D4/LCD_B0/EVENTOUT) U4.49
PE5: U1.D1(PE5/TRACED2/SAI1_CK2/DFSDM1_CKIN3/TIM15_CH1/SPI4_MISO/SAI1_SCK_A/SAI4_SCK_A/SAI4_CK2/FMC_A21/DCMI_D6/LCD_G0/EVENTOUT) U4.51
PE6: U1.E5(PE6/TRACED3/TIM1_BKIN2/SAI1_D1/TIM15_CH2/SPI4_MOSI/SAI1_SD_A/SAI4_SD_A/SAI4_D1/SAI2_MCLK_B/TIM1_BKIN2_COMP12/FMC_A22/DCMI_D7/LCD_G1/EVENTOUT) U4.41
PG2: U1.H16(PG2/TIM8_BKIN/TIM8_BKIN_COMP12/FMC_A12/EVENTOUT) U4.9
PG3: U1.H15(PG3/TIM8_BKIN2/TIM8_BKIN2_COMP12/FMC_A13/EVENTOUT) U5.8
PG7: U1.F16(PG7/HRTIM_CHE2/SAI1_MCLK_A/USART6_CK/FMC_INT/DCMI_D13/LCD_CLK/EVENTOUT) U4.11
PG9: U1.A10(PG9/SPI1_MISO/I2S1_SDI/USART6_RX/SPDIFRX1_IN4/QUADSPI_BK2_IO2/SAI2_FS_B/FMC_NE2/FMC_NCE/DCMI_VSYNC/EVENTOUT) U4.26
PG10: U1.A9(PG10/HRTIM_FLT5/SPI1_NSS/I2S1_WS/LCD_G3/SAI2_SD_B/FMC_NE3/DCMI_D2/LCD_B2/EVENTOUT) U4.32
PG11: U1.B9(PG11/LPTIM1_IN2/HRTIM_EEV4/SPI1_SCK/I2S1_CK/SPDIFRX1_IN1/SDMMC2_D2/ETH_MII_TX_EN/ETH_RMII_TX_EN/DCMI_D3/LCD_B3/EVENTOUT) U4.34
PG12: U1.C9(PG12/LPTIM1_IN1/HRTIM_EEV5/SPI6_MISO/USART6_RTS/USART6_DE/SPDIFRX1_IN2/LCD_B4/ETH_MII_TXD1/ETH_RMII_TXD1/FMC_NE4/LCD_B1/EVENTOUT) U4.36
PG13: U1.D9(PG13/TRACED0/LPTIM1_OUT/HRTIM_EEV10/SPI6_SCK/USART6_CTS/USART6_NSS/ETH_MII_TXD0/ETH_RMII_TXD0/FMC_A24/LCD_R0/EVENTOUT) U4.30
PG14: U1.D8(PG14/TRACED1/LPTIM1_ETR/SPI6_MOSI/USART6_TX/QUADSPI_BK2_IO3/ETH_MII_TXD1/ETH_RMII_TXD1/FMC_A25/LCD_B0/EVENTOUT) U4.28
PH4: U1.P3(PH4/I2C2_SCL/LCD_G5/OTG_HS_ULPI_NXT/LCD_G4/EVENTOUT) U5.52
PH5: U1.P4(PH5/I2C2_SDA/SPI5_NSS/FMC_SDNWE/EVENTOUT) U5.46
PH6: U1.T11(PH6/TIM12_CH1/I2C2_SMBA/SPI5_SCK/ETH_MII_RXD2/FMC_SDNE1/DCMI_D8/EVENTOUT) U5.27
PH7: U1.U13(PH7/I2C3_SCL/SPI5_MISO/ETH_MII_RXD3/FMC_SDCKE1/DCMI_D9/EVENTOUT) U5.25
PI8: U1.E4(PI8/EVENTOUT) U4.39
PI11: U1.F4(PI11/LCD_G6/OTG_HS_ULPI_DIR/EVENTOUT) U4.37
PI12: U1.H1(PI12/LCD_HSYNC/EVENTOUT) U4.53
PI13: U1.H2(PI13/LCD_VSYNC/EVENTOUT) U4.55
PI14: U1.H3(PI14/LCD_CLK/EVENTOUT) U4.57
PI15: U1.P5(PI15/LCD_G2/LCD_R0/EVENTOUT) U5.42
PJ0: U1.N6(PJ0/LCD_R7/LCD_R1/EVENTOUT) U5.38
PJ1: U1.P6(PJ1/LCD_R2/EVENTOUT) U5.36
PJ2: U1.T6(PJ2/LCD_R3/EVENTOUT) U5.33
PJ3: U1.U6(PJ3/LCD_R4/EVENTOUT) U5.31
PJ4: U1.U7(PJ4/LCD_R5/EVENTOUT) U5.29
PJ5: U1.R12(PJ5/LCD_R6/EVENTOUT) U5.30
PJ6: U1.N15(PJ6/TIM8_CH2/LCD_R7/EVENTOUT) U5.22
PJ7: U1.N14(PJ7/TRGIN/TIM8_CH2N/LCD_G0/EVENTOUT) U5.24
PJ8: U1.N13(PJ8/TIM1_CH3N/TIM8_CH1/UART8_TX/LCD_G1/EVENTOUT) U5.26
PJ9: U1.M14(PJ9/TIM1_CH3/TIM8_CH1N/UART8_RX/LCD_G2/EVENTOUT) U5.20
PJ10: U1.L14(PJ10/TIM1_CH2N/TIM8_CH2/SPI5_MOSI/LCD_G3/EVENTOUT) U5.16
PJ11: U1.K14(PJ11/TIM1_CH2/TIM8_CH2N/SPI5_MISO/LCD_G4/EVENTOUT) U5.14
PJ12: U1.D11(PJ12/TRGOUT/LCD_G3/LCD_B0/EVENTOUT) U4.16
PJ13: U1.E10(PJ13/LCD_B4/LCD_B1/EVENTOUT) U4.31
PJ14: U1.D10(PJ14/LCD_B2/EVENTOUT) U4.33
PJ15: U1.B10(PJ15/LCD_B3/EVENTOUT) U4.24
PK0: U1.J14(PK0/TIM1_CH1N/TIM8_CH3/SPI5_SCK/LCD_G5/EVENTOUT) U5.12
PK1: U1.J15(PK1/TIM1_CH1/TIM8_CH3N/SPI5_NSS/LCD_G6/EVENTOUT) U5.10
PK2: U1.H17(PK2/TIM1_BKIN/TIM8_BKIN/TIM8_BKIN_COMP12/TIM1_BKIN_COMP12/LCD_G7/EVENTOUT) U5.6
PK3: U1.C8(PK3/LCD_B4/EVENTOUT) U4.42
PK4: U1.B8(PK4/LCD_B5/EVENTOUT) U4.40
PK5: U1.A8(PK5/LCD_B6/EVENTOUT) U4.38
PK6: U1.C7(PK6/LCD_B7/EVENTOUT) U4.46
PK7: U1.D7(PK7/LCD_DE/EVENTOUT) U4.47
QSPI_BK1_IO0 / PF8: U1.K4(PF8/TIM16_CH1N/SPI5_MISO/SAI1_SCK_B/UART7_RTS/UART7_DE/SAI4_SCK_B/TIM13_CH1/QUADSPI_BK1_IO0/EVENTOUT) U3.5(DI(IO0))
QSPI_BK1_IO1 / PF9: U1.L4(PF9/TIM17_CH1N/SPI5_MOSI/SAI1_FS_B/UART7_CTS/SAI4_FS_B/TIM14_CH1/QUADSPI_BK1_IO1/EVENTOUT) U3.2(DO(IO1))
QSPI_BK1_IO2 / PF7: U1.K3(PF7/TIM17_CH1/SPI5_SCK/SAI1_MCLK_B/UART7_TX/SAI4_MCLK_B/QUADSPI_BK1_IO2/EVENTOUT) U3.3(WP#(IO2))
QSPI_BK1_IO3 / PF6: U1.K2(PF6/TIM16_CH1/SPI5_NSS/SAI1_SD_B/UART7_RX/SAI4_SD_B/QUADSPI_BK1_IO3/EVENTOUT) U3.7(HOLDor#/RESET#(IO3))
QSPI_BK1_NCS / PG6: U1.G15(PG6/TIM17_BKIN/HRTIM_CHE1/QUADSPI_BK1_NCS/FMC_NE3/DCMI_D12/LCD_R7/EVENTOUT) U3.1(CS#)
QSPI_CLK / PF10: U1.L3(PF10/TIM16_BKIN/SAI1_D3/QUADSPI_CLK/SAI4_D3/DCMI_D11/LCD_DE/EVENTOUT) U3.6(CLK)
RST: C28.1 Q1.3(C) R2.1 SW2.1 U1.K1(NRST) U4.3
SWCLK / PA14: JP1.4 U1.B14(PA14/JTCK-SWCLK/EVENTOUT) U4.7
SWDIO / PA13: JP1.5 U1.C15(PA13/JTMS-SWDIO/EVENTOUT) U4.5
VBAT: C39.1 D2.3 U1.B1(VBAT)
VBAT-EXT: D2.1 U5.60
VDDA: C35.2 C36.2 FB1.2 R8.1 U1.L1(VDDA)
VREF: C37.2 C38.2 R8.2 U1.M1(VREF+) U5.59
NetC1_2: C1.2 U1.A7(VCAP)
NetC2_2: C2.2 U1.D17(VCAP)
NetC3_2: C3.2 U1.U11(VCAP)
NetC29_1: C29.1 Q1.1(B) R3.2 R4.2
NetC34_1: C34.1 D1.2(K) Q2.1(B)
NetC41_1: C41.1 R11.2 R13.1 U6.2(FB3)
NetC42_1: C42.1 R10.1 R12.2 U6.3(FB2)
NetD1_1: D1.1(A) R3.1 SW1.2
NetL1_2: L1.2 U6.20(SW3)
NetL2_2: L2.2 U6.6(SW2)
NetLED2_1: LED2.1(A) R7.2
NetLED3_1: LED3.1(A) R9.2
NetQ2_3: Q2.3(C) R5.1
NetR1_2: R1.2 U1.E7(PDR_ON)

Not connected (* = marked no-connect by the designer): U1 E1(NC)* F1(NC1)* G2(NC2)* K16(NC)* K17(NC)* L16(NC)* L17(NC)* M16(NC)* M17(NC)* N17(NC)*; U2 K2(NU)*; U6 1(NC)* 4(NC)* 5(NC)* 9(EN1)* 10(VIN1)* 11(SW1)* 12(NC)* 13(NC)* 14(FB1)* 15(NC)* 16(NC)* 17(NC)*

### Notes on the sheet
- SDRAM
- FLASH
- 磁珠/120Ω ±25% @100MHz 200MA
- 晶振
- 复位
- LED
- STM32H750
- STM32电源

### Library data of the parts
*1-*4 = M3: 铜柱孔
C1-C48 = C: 贴片电容/MLCC电容
D1 = 1N4007: 整流二极管
D2 = BAT54C: 两路肖特基二极管
FB1 = FB: 贴片磁珠
JP1 = Header 7: 7P连接器
L1 L2 = L: 贴片小功率电感
LED1-LED3 = LED: 贴片LED
Q1 Q2 = 8050-SMD: 高频放大-NPN型
R1-R13 = R: 贴片电阻
U1 = STM32H750XBH6: ARMÂ® CortexÂ®-M7 STM32H7 Microcontroller IC 32-Bit 480MHz 128KB (128K x 8) FLASH 240+25-TFBGA (14x14)
U2 = MT48LC4M32B2B5-6A:L: SDRAM Memory IC 128Mb _4M x 32_ Parallel 167MHz 5.4ns 90-VFBGA _8x13_
X1 = XTAL-4P: 4脚无源晶振(谐振器）
X2 = XTAL-2P: 2脚无源晶振(谐振器）